# EAGLE design main (EAGLE 7.7.0)
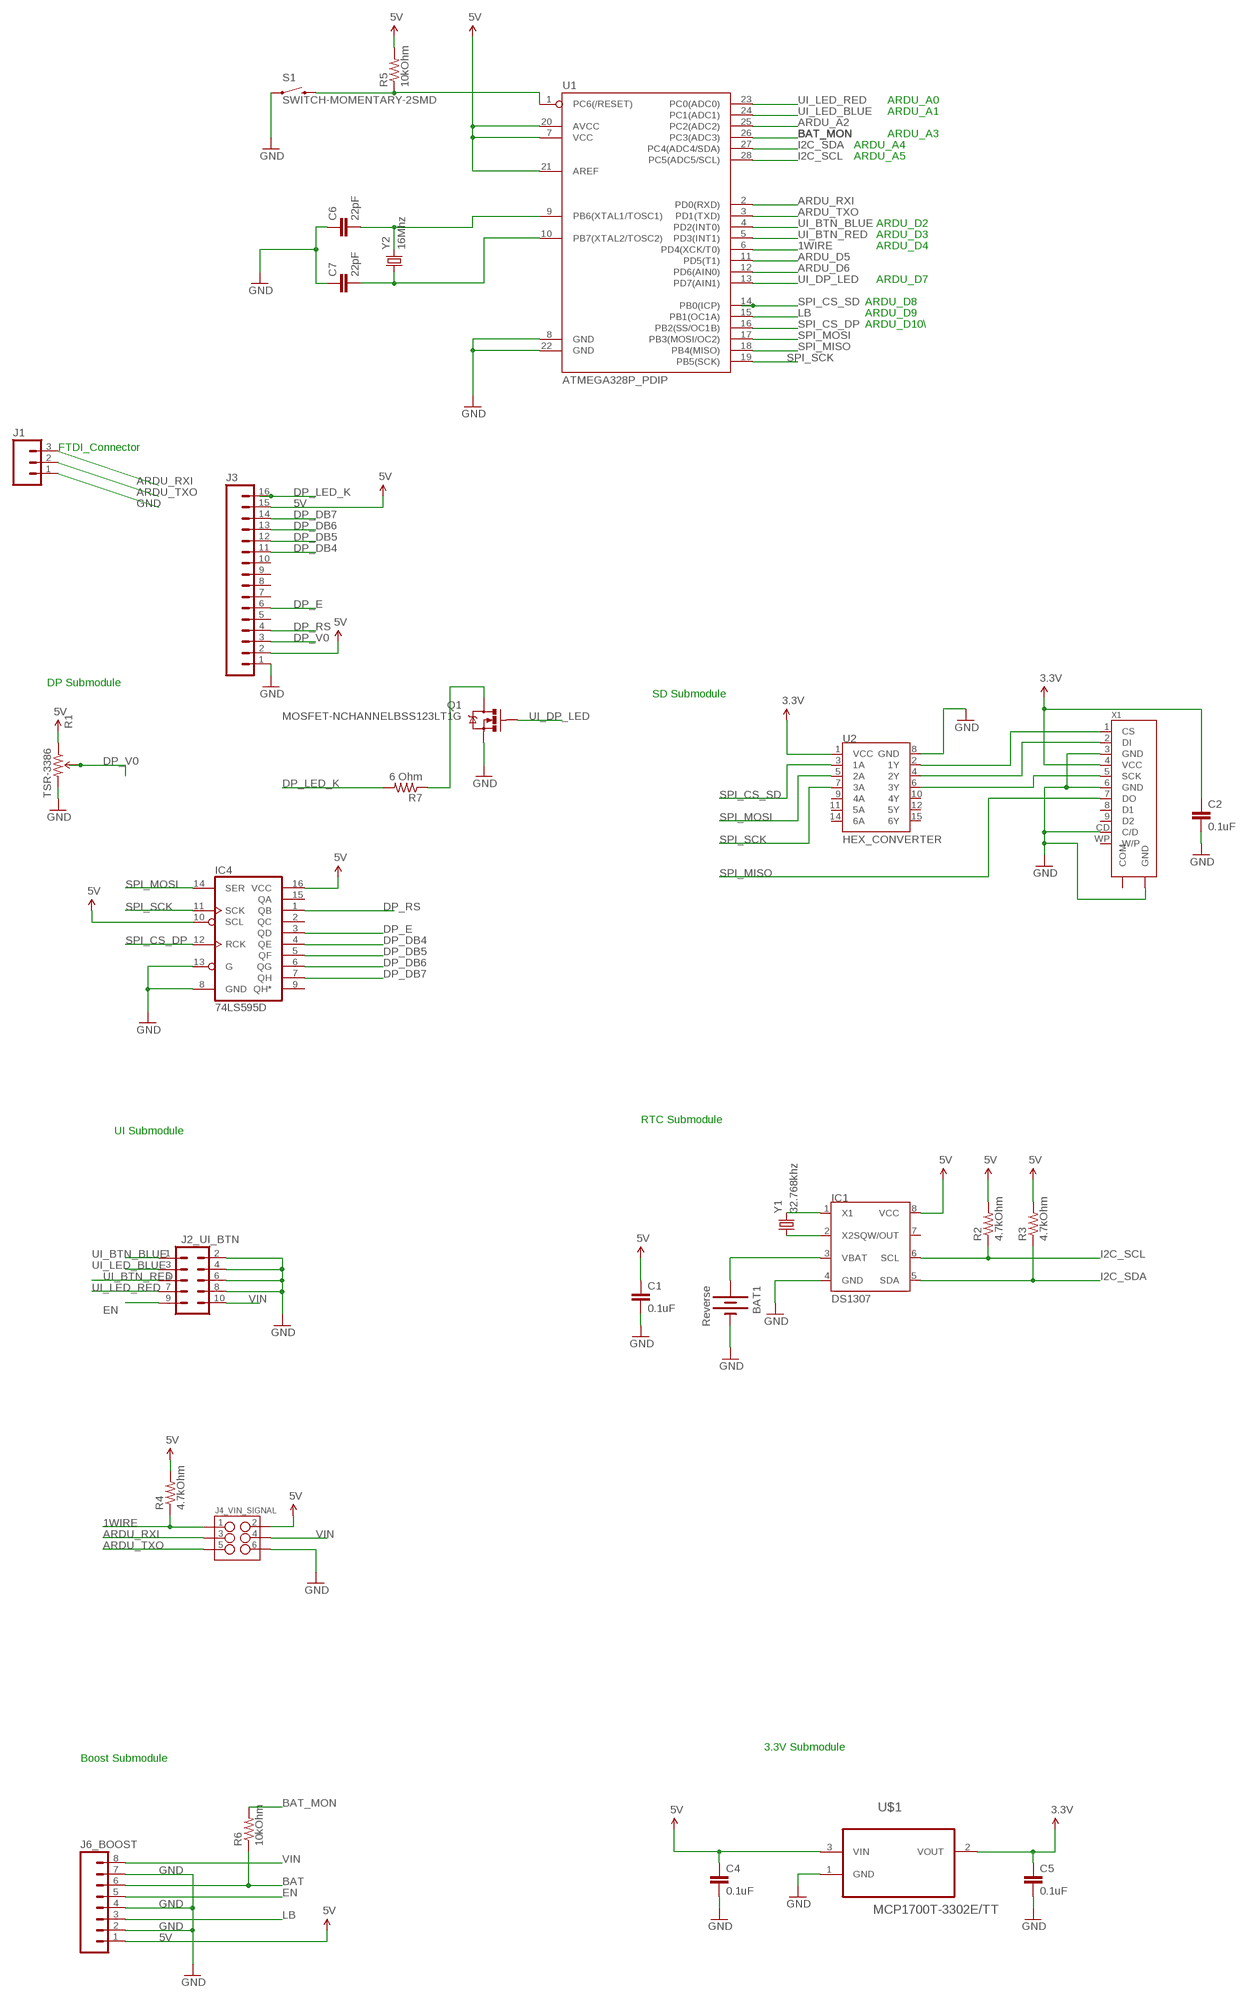
[diagram p0: schematic, sheet 1]

## Parts
BAT1  Reverse  BATTERY20PTH  [BATTCOM_20MM_PTH]
C1  0.1uF  CAP1206  [1206]
C2  0.1uF  CAP1206  [1206]
C4  0.1uF  CAP1206  [1206]
C5  0.1uF  CAP1206  [1206]
C6  22pF  CAP1206  [1206]
C7  22pF  CAP1206  [1206]
IC1  DS1307  [SOIC-8]
IC4  74LS595D  [SO16]
J1  M03LOCK  [1X03_LOCK]
J2_UI_BTN  M05X2SHD  [2X5-SHROUDED]
J3  M16PTH  [1X16]
J4_VIN_SIGNAL  M03X2SHROUD  [2X3-SHROUDED]
J6_BOOST  M08  [1X08_ROUND]
Q1  MOSFET-NCHANNELBSS123LT1G  [SOT23-3]
R1  TSR-3386  TRIMPOT-PTH-KNOB  [3386U]
R2  4.7kOhm  RESISTOR1206  [1206]
R3  4.7kOhm  RESISTOR1206  [1206]
R4  4.7kOhm  RESISTOR1206  [1206]
R5  10kOhm  RESISTOR1206  [1206]
R6  10kOhm  RESISTOR1206  [1206]
R7  6 Ohm  RESISTOR1206  [1206]
S1  SWITCH-MOMENTARY-2SMD  [TACTILE-SWITCH-SMD]
U1  ATMEGA328P_PDIP  [DIL28-3]
U2  HEX_CONVERTER  [SO016]
U$1  MCP1700T-3302E/TT  [SOT95P237X112-3N]
X1  SD-SOCKET-AVX  [SD-SOCKET-AVX]
Y1  32.768khz  CRYSTAL32-SMD-MELF  [CRYSTAL-32KHZ-SMD-MELF]
Y2  16Mhz  CRYSTALHC49US  [HC49US]

## Nets
1WIRE: J4_VIN_SIGNAL.1 R4.1 U1.6(PD4(XCK/T0))
3.3V [PWR]: C2.1 C5.1 U2.1(VCC) U$1.2(VOUT) X1.4(VCC)
5V [PWR]: C1.1 C4.1 IC1.8(VCC) IC4.10(SCL) IC4.16(VCC) J3.2 J3.15 J4_VIN_SIGNAL.2 J6_BOOST.1 R1.1(CCW) R2.2 R3.2 R4.2 R5.2 U1.7(VCC) U1.20(AVCC) U1.21(AREF) U$1.3(VIN)
ARDU_A2: U1.25(PC2(ADC2))
ARDU_D5: U1.11(PD5(T1))
ARDU_D6: U1.12(PD6(AIN0))
ARDU_RXI: J1.3 J4_VIN_SIGNAL.3 U1.2(PD0(RXD))
ARDU_TXO: J1.2 J4_VIN_SIGNAL.5 U1.3(PD1(TXD))
BAT: J6_BOOST.6 R6.1
BAT_MON: R6.2 U1.26(PC3(ADC3))
DP_DB4: IC4.4(QE) J3.11
DP_DB5: IC4.5(QF) J3.12
DP_DB6: IC4.6(QG) J3.13
DP_DB7: IC4.7(QH) J3.14
DP_E: IC4.3(QD) J3.6
DP_LED_K [PWR]: J3.16 R7.2
DP_RS: IC4.1(QB) J3.4
DP_V0: J3.3 R1.2(WIPER)
EN: J2_UI_BTN.9 J6_BOOST.5
GND [PWR]: BAT1.2(-) C1.2 C2.2 C4.2 C5.2 C6.1 C7.1 IC1.4(GND) IC4.8(GND) IC4.13(G) J1.1 J2_UI_BTN.2 J2_UI_BTN.4 J2_UI_BTN.6 J2_UI_BTN.8 J3.1 J4_VIN_SIGNAL.6 J6_BOOST.2 J6_BOOST.4 J6_BOOST.7 Q1.2(S) R1.3(CW) S1.1 U1.8(GND) U1.22(GND) U2.8(GND) U$1.1(GND) X1.3(GND) X1.6(GND) X1.CD(C/D) X1.GND@2(GND)
I2C_SCL: IC1.6(SCL) R2.1 U1.28(PC5(ADC5/SCL))
I2C_SDA: IC1.5(SDA) R3.1 U1.27(PC4(ADC4/SDA))
LB: J6_BOOST.3 U1.15(PB1(OC1A))
N$1: BAT1.1(+) IC1.3(VBAT)
N$2: IC1.2(X2) Y1.X1
N$3: IC1.1(X1) Y1.X2
N$4: U2.2(1Y) X1.1(CS)
N$5: U2.4(2Y) X1.2(DI)
N$6: U2.6(3Y) X1.5(SCK)
N$7: R5.1 S1.3 U1.1(PC6(/RESET))
N$8 [PWR]: Q1.3(D) R7.1
N$10: C6.2 U1.9(PB6(XTAL1/TOSC1)) Y2.2
N$11: C7.2 U1.10(PB7(XTAL2/TOSC2)) Y2.1
SPI_CS_DP: IC4.12(RCK) U1.16(PB2(SS/OC1B))
SPI_CS_SD: U1.14(PB0(ICP)) U2.3(1A)
SPI_MISO: U1.18(PB4(MISO)) X1.7(DO)
SPI_MOSI: IC4.14(SER) U1.17(PB3(MOSI/OC2)) U2.5(2A)
SPI_SCK: IC4.11(SCK) U1.19(PB5(SCK)) U2.7(3A)
UI_BTN_BLUE: J2_UI_BTN.1 U1.4(PD2(INT0))
UI_BTN_RED: J2_UI_BTN.5 U1.5(PD3(INT1))
UI_DP_LED: Q1.1(G) U1.13(PD7(AIN1))
UI_LED_BLUE: J2_UI_BTN.3 U1.24(PC1(ADC1))
UI_LED_RED: J2_UI_BTN.7 U1.23(PC0(ADC0))
VIN: J2_UI_BTN.10 J4_VIN_SIGNAL.4 J6_BOOST.8
Unconnected: IC1.7(SQW/OUT) IC4.2(QC) IC4.9(QH*) IC4.15(QA) J3.5 J3.7 J3.8 J3.9 J3.10 U2.9(4A) U2.10(4Y) U2.11(5A) U2.12(5Y) U2.14(6A) U2.15(6Y) X1.8(D1) X1.9(D2) X1.COM X1.WP(W/P)

## Notes on the sheet
- ARDU_A0
- ARDU_A1
- ARDU_A3
- ARDU_A4
- ARDU_A5
- ARDU_D2
- ARDU_D3
- ARDU_D4
- ARDU_D7
- ARDU_D8
- ARDU_D9
- ARDU_D10\
- FTDI_Connector
- DP Submodule
- SD Submodule
- RTC Submodule
- UI Submodule
- 3.3V Submodule
- Boost Submodule

## Library data of the parts
BAT1 = SparkFun-Electromechanical:BATTERY: Battery Holders Various common sizes : AA, AAA, 18650 (PRT-12895), 20mm coin cell and 12mm coin cell. 20MM_4LEGS, BATT-10373
C1 C2 C4-C7 = SparkFun-Passives:CAP: Capacitor Standard 0603 ceramic capacitor, and 0.1" leaded capacitor.
IC1 = dallas-1:DS1307: I2C Serial RTC w/56 bytes battery backed RAM
IC4 = SparkFun-DigitalIC:74*595: 8-bit SHIFT REGISTER, output latch; PROD_ID: IC-07875
J1 = SparkFun-Connectors:M03: Header 3 Standard 3-pin 0.1" header. Use with straight break away headers (SKU : PRT-00116), right angle break away headers (PRT-00553), swiss pins (PRT-00743), machine pins (PRT-00117), and female headers (PRT-00115). Molex polarized connector foot print use with SKU : PRT-08232 with associated crimp pins and housings.
J2_UI_BTN = SparkFun-Connectors:M05X2: Header 5x2 Standard 10-pin dual row 0.1" header. Commonly used with AVR-ISP. Use with Spark Fun Electronics SKU: PRT-00778
J3 = SparkFun-Connectors:M16: 1x16 .1" header
J4_VIN_SIGNAL = SparkFun-Connectors:M03X2: 2x3 .1" header. Shrouded, with keying- CONN-10681 SMT- CONN-11415 Pogo pins- HW-11044; PROD_ID: CONN-10681
J6_BOOST = SparkFun-Connectors:M08: Header 8 Standard 8-pin 0.1" header. Use with straight break away headers (SKU : PRT-00116), right angle break away headers (PRT-00553), swiss pins (PRT-00743), machine pins (PRT-00117), and female headers (PRT-00115).; PROD_ID: CONN-08437
Q1 = SparkFun-DiscreteSemi:MOSFET-NCHANNEL: Common NMOSFET Parts MFG P/N Store ID Prod ID FDD8780 TRANS-09984 SI7820DN TRANS-11055 FDS6630A IC-08089 2N7002PW TRANS-11151 FQP30N06L COM-10213 TRANS-10060 BSS123LT1G TRANS-08345 BSS138 TRANS-00830 BS170 2N7000; PROD_ID: TRANS-08345
R1 = SparkFun-Electromechanical:TRIMPOT: Various small potentiometers for "set-and-forget" applications; PROD_ID: RES-09730
R2-R7 = SparkFun-Resistors:RESISTOR: Resistor Basic schematic elements and footprints for 0603, 1206, and PTH resistors.
S1 = SparkFun-Electromechanical:SWITCH-MOMENTARY-2: Various NO switches- pushbuttons, reed, etc; PROD_ID: SWCH-08247
U1 = SparkFun-DigitalIC:ATMEGA328P_PDIP: uC used in the Arduino 32kb flash, 1k EEPROM, 2k SRAM This is the through-hole version of this chip.
U2 = SparkFun-DigitalIC:HEX_CONVERTER: 74HC4050 Hex Buffer Level Shifter SMD SO016; PROD_ID: IC-09604
U$1 = Microchip_By_element14_Batch_1:MCP1700T-3302E/TT: Low Quiescent Current LDO; MPN: MCP1700T-3302E/TT; OC_FARNELL: 1296592; OC_NEWARK: 88H9817; PACKAGE: SOT23-3; SUPPLIER: Microchip
X1 = Lumisense-SD-Socket:SD-SOCKET: SD-SOCKET; LPN: 181; NOTES: DIGIKEY 478-4061-1-ND
Y1 = SparkFun-FreqCtrl:CRYSTAL: Various standard crystals. Proven footprints.; PROD_ID: XTAL-07894
Y2 = SparkFun-FreqCtrl:CRYSTAL: Various standard crystals. Proven footprints.

## Net classes
1 PWR: width 0.254 mm, clearance 0.076 mm
2 3.3V: width 0.254 mm, clearance 0.127 mm

## Board
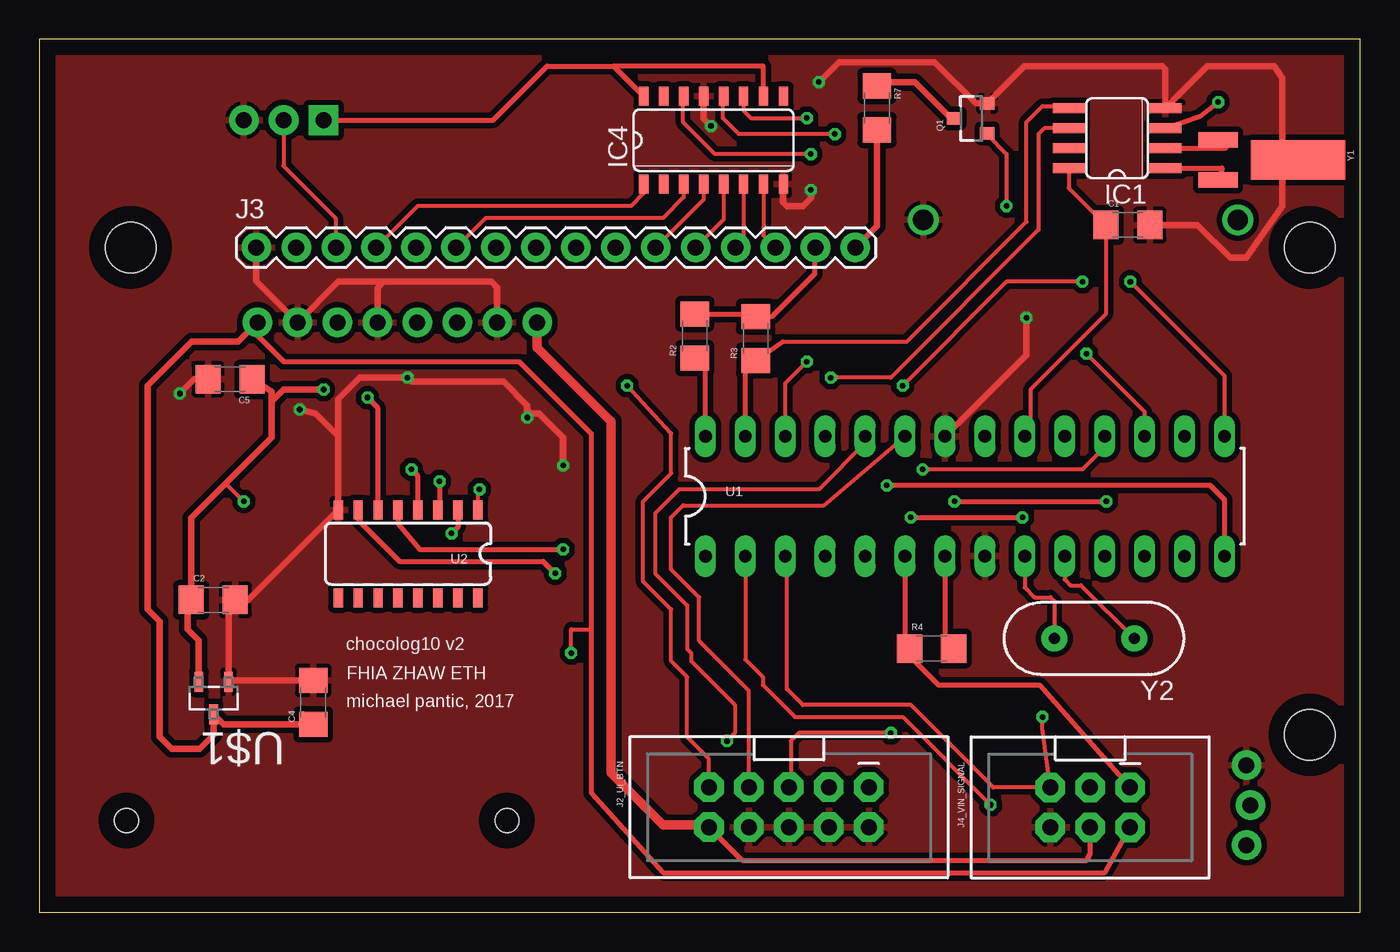
[diagram p1: board, top side]
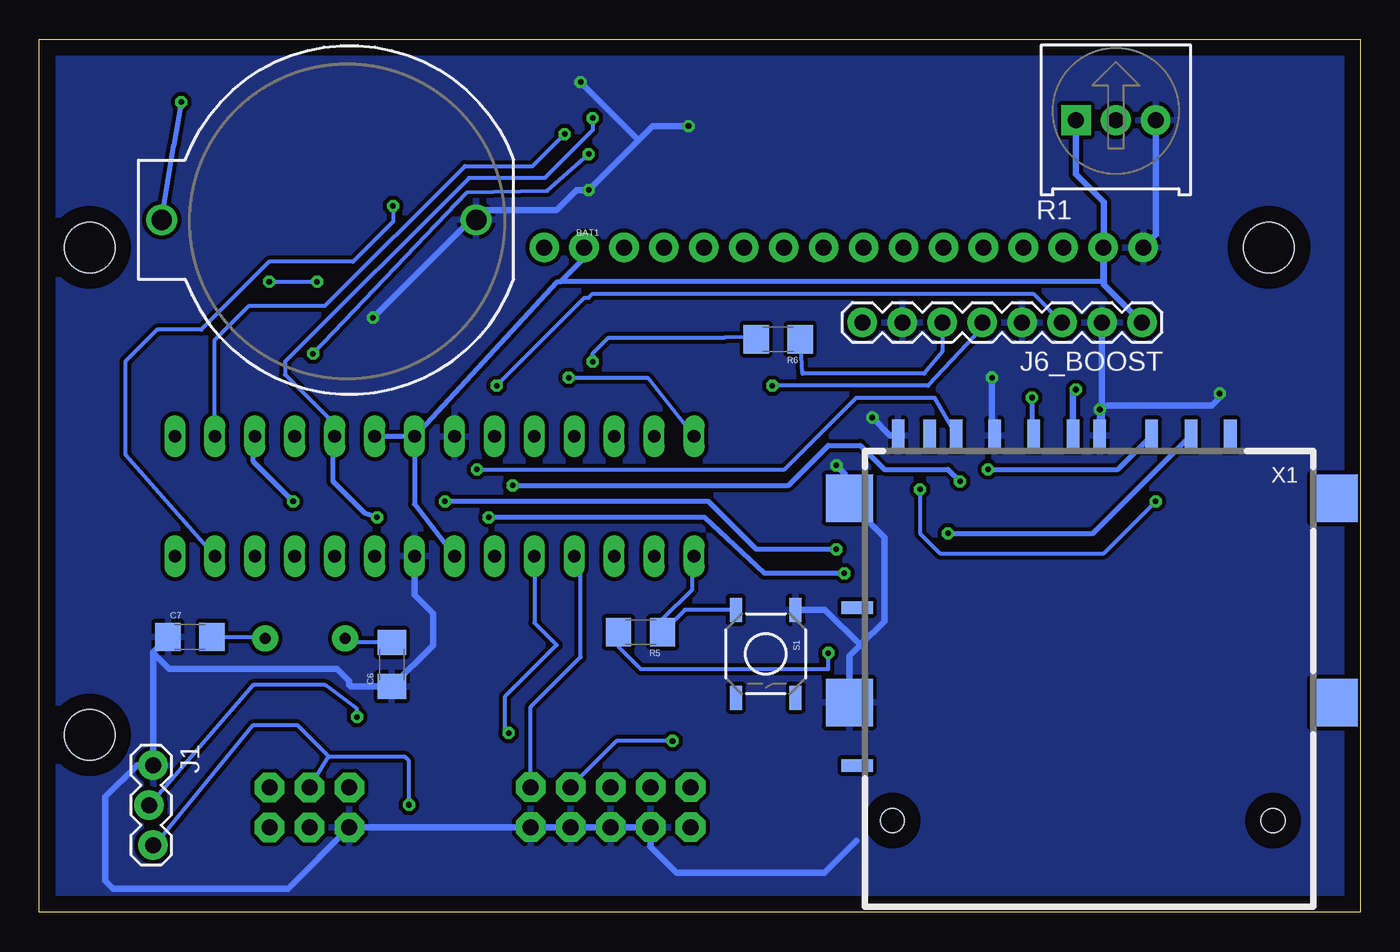
[diagram p2: board, bottom side, seen from below]

Size 84.01 x 55.53 mm. Coordinates in mm from the lower left corner, seen from the top.
Outline: 0,0 84.01,0 84.01,55.53 0,55.53 0,0
Copper layers (1*16): Top 0.035mm / dielectric 1.5mm / Bottom 0.035mm
Design rules "default *": minimum track width 9mil, minimum drill 0.3mm, track to track 10mil, track to pad 10mil, pad to pad 10mil, via to via 10mil, smd to smd 10mil, copper to edge 40mil, drill to drill 8mil, minimum pad ring 10mil, minimum via ring 8mil, stop-mask expansion 4mil, vias tented up to drill 0mil, thermal gap 10mil
Holes 3.2 mm at 5.8,42.29 80.8,42.29 80.8,11.29

### Footprints (pad centres in the part's own frame; a part is rotated, then mirrored left to right if it is on the bottom)
BATTCOM_20MM_PTH = drill 1.3: 1 11.85,0; 2 -8.15,0
1206 = smd 1.6 x 1.8: 1 -1.4,0; 2 1.4,0
SOIC-8 = smd 2.032 x 0.66: 1 -3.073,1.27; 2 -3.073,0; 3 -3.073,-1.27; 4 -3.073,-2.54; 5 3.073,-2.54; 6 3.073,-1.27; 7 3.073,0; 8 3.073,1.27
SO16 = smd 0.6 x 1.2: 1 -4.445,-2.8; 2 -3.175,-2.8; 3 -1.905,-2.8; 4 -0.635,-2.8; 5 0.635,-2.8; 6 1.905,-2.8; 7 3.175,-2.8; 8 4.445,-2.8; 9 4.445,2.8; 10 3.175,2.8; 11 1.905,2.8; 12 0.635,2.8; 13 -0.635,2.8; 14 -1.905,2.8; 15 -3.175,2.8; 16 -4.445,2.8
1X03_LOCK = drill 1.016 pad 1.88: 1 0,0.127; 2 2.54,-0.127; 3 5.08,0.127
2X5-SHROUDED = drill 1.016 pad 1.88 octagon: 1 -1.27,5.08; 2 1.27,5.08; 3 -1.27,2.54; 4 1.27,2.54; 5 -1.27,0; 6 1.27,0; 7 -1.27,-2.54; 8 1.27,-2.54; 9 -1.27,-5.08; 10 1.27,-5.08
1X16 = drill 1.016 pad 1.88: 1 0,0; 2 2.54,0; 3 5.08,0; 4 7.62,0; 5 10.16,0; 6 12.7,0; 7 15.24,0; 8 17.78,0; 9 20.32,0; 10 22.86,0; 11 25.4,0; 12 27.94,0; 13 30.48,0; 14 33.02,0; 15 35.56,0; 16 38.1,0
2X3-SHROUDED = drill 1.016 pad 1.88 octagon: 1 -1.27,2.54; 2 1.27,2.54; 3 -1.27,0; 4 1.27,0; 5 -1.27,-2.54; 6 1.27,-2.54
1X08_ROUND = drill 1.016 pad 1.88: 1 0,0; 2 2.54,0; 3 5.08,0; 4 7.62,0; 5 10.16,0; 6 12.7,0; 7 15.24,0; 8 17.78,0
SOT23-3 = smd 0.8 x 0.9: 1 -0.95,-1; 2 0.95,-1; 3 0,1.1
3386U = drill 1.016 pad 1.88 square: 1 -2.54,-0.015 | drill 1.016 pad 1.88: 2 0,-0.015; 3 2.54,-0.015
TACTILE-SWITCH-SMD = smd 1.524 x 0.762: 1 -2.794,1.905; 2 2.794,1.905; 3 -2.794,-1.905; 4 2.794,-1.905
DIL28-3 = drill 0.813 long: 1 -16.51,-3.81; 2 -13.97,-3.81; 3 -11.43,-3.81; 4 -8.89,-3.81; 5 -6.35,-3.81; 6 -3.81,-3.81; 7 -1.27,-3.81; 8 1.27,-3.81; 9 3.81,-3.81; 10 6.35,-3.81; 11 8.89,-3.81; 12 11.43,-3.81; 13 13.97,-3.81; 14 16.51,-3.81; 15 16.51,3.81; 16 13.97,3.81; 17 11.43,3.81; 18 8.89,3.81; 19 6.35,3.81; 20 3.81,3.81; 21 1.27,3.81; 22 -1.27,3.81; 23 -3.81,3.81; 24 -6.35,3.81; 25 -8.89,3.81; 26 -11.43,3.81; 27 -13.97,3.81; 28 -16.51,3.81
SO016 = smd 0.6 x 1.2: 1 -4.445,-2.8; 2 -3.175,-2.8; 3 -1.905,-2.8; 4 -0.635,-2.8; 5 0.635,-2.8; 6 1.905,-2.8; 7 3.175,-2.8; 8 4.445,-2.8; 9 4.445,2.8; 10 3.175,2.8; 11 1.905,2.8; 12 0.635,2.8; 13 -0.635,2.8; 14 -1.905,2.8; 15 -3.175,2.8; 16 -4.445,2.8
SOT95P237X112-3N = smd 0.559 x 1.27: 1 -0.94,-1.041; 2 0.94,-1.041; 3 0,1.041
SD-SOCKET-AVX = smd 0.8 x 2: 1 -6.88,-1; 2 -4.38,-1; 3 -1.08,-1; 4 0.62,-1; 5 3.12,-1; 6 5.62,-1; 7 8.05,-1; 8 9.75,-1; 9 -9.38,-1; CD 11.75,-1 | smd 2 x 0.8: COM 14.35,9.95; WP 14.35,20 | smd 3 x 3: GND@1 -16,3; GND@2 14.85,16; GND@3 -16,16; GND@4 14.85,3 | hole 1.5: 12.1,23.5; -12.1,23.5
CRYSTAL-32KHZ-SMD-MELF = smd 2.5 x 6: SHEILD 0,5.08 | smd 1 x 2.5: X1 -1.27,0; X2 1.27,0
HC49US = drill 0.7 pad 1.651: 1 -2.54,0; 2 2.54,0

### Placement (x,y rotation side)
BAT1  64.38,44.05 180 bottom
C1  69.23,43.72 0 top
C2  11.06,19.88 0 top
C4  17.42,13.36 90 top
C5  12.13,33.91 180 top
C6  61.59,15.76 90 bottom
C7  74.43,17.52 0 bottom
IC1  68.54,48.61 180 top
IC4  42.88,49.11 0 top
J1  76.9,9.35 270 bottom
J2_UI_BTN  47.67,6.69 270 top
J3  13.8,42.29 0 top
J4_VIN_SIGNAL  66.83,6.67 270 top
J6_BOOST  13.88,37.52 180 bottom
Q1  59.29,50.5 90 top
R1  15.54,50.4 0 bottom
R2  41.68,36.66 90 top
R3  45.56,36.5 90 top
R4  56.75,16.78 0 top
R5  45.77,17.82 180 bottom
R6  37.01,36.45 180 bottom
R7  53.27,51.17 270 top
S1  37.81,16.44 270 bottom
U1  58.87,26.47 0 top
U2  23.45,22.8 180 top
U$1  11.09,13.63 180 top
X1  17.64,29.34 180 bottom
Y1  74.97,47.86 270 top
Y2  67.09,17.42 180 top

### Tracks (layer width: path | path; a pad name or v marks a point on that pad's centre or on a via)
1WIRE
  Top 0.305: U1.6 55.06,17.07 R4.1 55.35,16.3 57.2,14.45 63.62,14.45 J4_VIN_SIGNAL.1
3.3V  (via drill 0.36)
  Top 0.254: U2.1 27.9,26.81 v27.99,26.9 | v13,26.14 11.86,27.28
  Top 0.406: C2.1 9.66,19.82 9.7,19.79 | U$1.2 10.15,17.31 9.45,18.01 9.45,19.66 C2.1 | C2.1 9.66,25.09 11.86,27.28 14.78,30.2 14.78,32.49 | 14.78,32.49 14.78,33.13 C5.1 | v18.08,33.25 15.54,33.25 14.78,32.49
  Bottom 0.254: v27.99,26.9 27.99,24.11 26.72,22.84 16.3,22.84 v13,26.14
  Bottom 0.406: X1.4 18.26,33.07 v18.08,33.25
5V  (via drill 0.36)
  Top 0.254: IC1.8 65.47,46.08 C1.1 67.83,38.04 63.04,33.25 63.04,31.4 U1.20 | v33.83,16.49 33.83,18.01 35.1,18.01
  Top 0.305: U1.7 57.6,17.33 R4.2 | R2.2 45.4,38.06 R3.2 46.61,37.9 49.32,40.62 49.32,42.25 J3.15 | R1.1 28.87,50.39 32.31,53.82 36.52,53.82 | 36.52,53.82 IC4.16 | IC4.10 46.06,53.79 46.02,53.82 36.52,53.82 | J6_BOOST.1 13.88,36.69 15.54,35.03 30.53,35.03 35.1,30.46 35.1,18.01 35.1,7.6 39.67,2.52 67.76,2.52 J4_VIN_SIGNAL.2
  Top 0.406: 16.79,12.59 C4.1 11.72,11.96 U$1.3 11.09,11.27 10.21,10.39 8.43,10.39 7.67,11.15 7.67,18.52 6.91,19.28 6.91,33.5 9.7,36.3 12.66,36.3 J6_BOOST.1
  Bottom 0.254: R5.2 47.17,16.87 45.77,15.47 33.83,15.47 v33.83,16.49
  Bottom 0.305: 16.3,40.11 50.85,40.11 | U1.21 51.07,40.11 50.85,40.11 | U1.21 U1.20 | U1.21 60.14,25.96 U1.7 | 50.85,40.11 49.32,41.63 49.32,42.25 J3.15 49.36,42.61 49.32,42.65
  Bottom 0.406: R1.1 18.08,46.96 16.3,45.19 16.3,40.31 | 16.3,40.31 16.3,40.11 16.3,39.94 J6_BOOST.1 | J3.2 16.34,40.35 16.3,40.31
ARDU_RXI  (via drill 0.36)
  Top 0.254: U1.2 44.9,16.08 46.02,14.96 46.02,14.45 48.05,12.42 54.91,12.42 v60.5,6.83
  Bottom 0.254: v60.5,6.83 60.5,9.63 60.75,9.88 65.58,9.88 | 65.58,9.88 65.65,9.88 J4_VIN_SIGNAL.3 | J1.3 76.27,4.78 70.41,11.91 67.61,11.91 65.58,9.88
ARDU_TXO  (via drill 0.36)
  Top 0.254: U1.3 47.55,22.55 47.55,14.2 48.56,13.18 55.42,13.18 60.66,7.94 J4_VIN_SIGNAL.5 63.78,11.68 v63.8,12.42
  Bottom 0.254: v63.8,12.42 63.8,12.93 65.83,14.45 70.4,14.45 J1.2
BAT
  Bottom 0.254: J6_BOOST.6 26.58,35.67 27.73,34.27 35.46,34.27 R6.1
BAT_MON  (via drill 0.36)
  Top 0.254: U1.26 47.44,33.65 v48.82,35.03
  Bottom 0.254: R6.2 38.94,36.58 40.43,36.55 47.8,36.55 48.82,35.54 v48.82,35.03
DP_DB4
  Top 0.254: IC4.4 42.25,45.34 J3.11
DP_DB5
  Top 0.254: IC4.5 43.52,44.06 J3.12
DP_DB6
  Top 0.254: IC4.6 44.79,42.79 J3.13
DP_DB7
  Top 0.254: IC4.7 46.06,43.05 J3.14
DP_E
  Top 0.254: IC4.3 40.98,45.48 39.67,44.17 28.38,44.17 J3.6
DP_LED_K
  Top 0.406: R7.2 53.27,43.66 J3.16
DP_RS
  Top 0.254: IC4.1 38.44,45.73 37.64,44.93 24.07,44.93 J3.4
DP_V0
  Top 0.254: R1.2 15.54,47.48 18.84,44.17 18.84,42.11 18.84,41.89 19.1,41.63
  Top 0.406: J3.3 18.88,42.15 18.84,42.11
EN  (via drill 0.36)
  Top 0.254: J2_UI_BTN.9 42.59,9.76 41.2,11.15 41.2,14.96 40.18,15.98 40.18,19.28 38.4,21.06 38.4,26.14 40.18,27.92 40.18,30.46 v37.39,33.5
  Bottom 0.254: J6_BOOST.5 24.04,37.2 27.48,33.5 v37.39,33.5
GND  (via drill 0.36)
  Top 0.406: J3.1 13.8,40.14 J6_BOOST.2 19.01,40.11 21.89,40.11 | J6_BOOST.7 29.12,39.74 28.75,40.11 21.89,40.11 | J6_BOOST.4 21.5,39.72 21.89,40.11 | IC4.13 42.25,50.49 v42.72,50.01 | v49.07,45.95 49.07,45.44 48.56,44.93 47.55,44.93 47.29,45.19 47.29,46.27 IC4.8 | C1.2 73.65,43.72 75.74,41.63 76.76,41.63 79.04,44.93 79.04,53.06 78.53,53.82 74.29,53.82 IC1.4 71.62,53.63 71.42,53.82 62.66,53.82 Q1.2 59.57,51.45 56.94,54.08 50.85,54.08 v49.58,52.81 | C4.2 12.12,14.76 U$1.1 12.03,19.44 C2.2 13.29,19.88 U2.8 19.01,30.29 | 19.01,30.29 17.57,31.73 v16.56,31.98 | C5.2 9.85,33.91 v8.94,33 | 19.01,30.29 19.01,32.65 20.37,34.01 v23.42,34.01 23.67,33.76 29.51,33.76 31.04,32.23 31.04,31.98 | v31.04,31.47 31.04,31.98 | v33.32,28.42 33.32,30.2 31.8,31.73 31.29,31.73 31.04,31.98 | v62.79,37.82 62.79,35.46 U1.22
  Bottom 0.406: R1.3 13,43.09 J3.1 | v42.72,50.01 45.01,50.01 45.9,49.12 | 45.9,49.12 v49.07,45.95 49.83,45.95 51.1,44.68 55.59,44.68 BAT1.2 56.56,44.05 v62.79,37.82 | v49.58,52.81 45.9,49.12 | 76.78,16.49 J1.1 77.8,9.35 79.8,7.34 79.8,2.01 79.3,1.5 68.19,1.5 J4_VIN_SIGNAL.6 52.77,5.4 J2_UI_BTN.2 J2_UI_BTN.4 J2_UI_BTN.6 J2_UI_BTN.8 45.13,4.17 43.48,2.52 34.08,2.52 32.05,4.55 | 76.78,16.49 76.78,16.57 C7.1 | 32.05,12.9 X1.GND@2 32.49,16.3 31.8,16.99 | 31.8,16.99 30.27,18.52 30.27,23.85 32.81,26.39 32.81,27.92 v33.32,28.42 | S1.1 34.04,19.24 31.8,16.99 | J6_BOOST.2 16.42,30.48 X1.3 v16.56,31.98 16.05,32.23 9.45,32.23 8.94,32.74 v8.94,33 | v23.42,34.01 23.42,30.49 X1.6 | X1.CD 29.9,30.34 v31.04,31.47 | U1.8 60.14,20.19 58.98,19.03 58.98,16.97 C6.1 64.22,14.36 64.31,14.45 64.31,14.71 65.07,15.47 75.76,15.47 76.78,16.49
  pour Bottom (isolate 0.254): 0.56,54.84 0.56,0.23 82.85,0.23 83.11,54.84
  pour Top (isolate 0.356): 0.3,54.84 82.85,54.84 82.85,0.23 0.3,0.23
I2C_SCL  (via drill 0.36)
  Top 0.254: IC1.6 63.92,49.88 63.55,49.51 63.55,43.41 54.15,34.01 v50.34,34.01
  Top 0.305: U1.28 42.36,34.58 R2.1
  Bottom 0.254: v50.34,34.01 45.33,34.01 U1.28
I2C_SDA
  Top 0.254: 47.29,36.3 55.17,36.3 62.79,43.92 62.79,50.27 63.8,51.28 65.73,51.28 66.09,51.28 66.34,51.03
  Top 0.305: U1.27 44.9,34.44 R3.1 45.58,35.1 47.29,36.3
  Top 0.406: IC1.5 65.6,51.15 65.73,51.28
LB  (via drill 0.36)
  Top 0.254: U1.15 75.38,34.12 v69.39,40.11 | v66.34,40.11 61.52,40.11 v54.91,33.5
  Bottom 0.254: v69.39,40.11 v66.34,40.11 | v54.91,33.5 49.32,39.09 49.07,39.09 48.82,39.35 20.79,39.35 J6_BOOST.3
N$1  (via drill 0.36)
  Top 0.305: IC1.3 73.83,50.64 v74.98,51.54
  Bottom 0.305: BAT1.1 75.46,48.77 v74.98,51.54
N$2
  Top 0.305: IC1.2 75.47,48.61 Y1.X1
N$3
  Top 0.305: IC1.1 75.23,47.34 Y1.X2
N$4  (via drill 0.36)
  Top 0.305: U2.2 26.63,24.52 v26.21,24.11
  Bottom 0.305: v26.21,24.11 16.99,24.11 X1.1
N$5  (via drill 0.36)
  Top 0.305: U2.4 24.09,27.75 v23.67,28.17
  Bottom 0.305: v23.67,28.17 15.43,28.17 X1.2
N$6  (via drill 0.36)
  Top 0.305: U2.6 21.55,32.07 v20.88,32.74
  Bottom 0.305: v20.88,32.74 20.88,30.45 X1.5
N$7
  Bottom 0.254: S1.3 42.95,19.24 R5.1 44.37,18.65 42.47,20.55 42.47,22.55 U1.1
N$8
  Top 0.406: Q1.3 57.98,50.5 55.67,52.81 53.51,52.81 R7.1
N$10
  Top 0.254: U1.9 62.68,20.65 63.29,20.04 64.31,20.04 64.56,19.79 64.56,17.43 Y2.2
  Bottom 0.254: C6.2 64.29,17.16 Y2.2
N$11
  Top 0.254: U1.10 65.22,21.16 65.58,20.8 66.25,20.8 Y2.1
  Bottom 0.254: C7.2 69.73,17.52 Y2.1
SPI_CS_DP  (via drill 0.36)
  Top 0.254: v50.59,49.51 44.5,49.51 43.48,50.52 43.48,51.88 IC4.12
  Bottom 0.254: U1.16 72.84,36.4 70.66,38.58 65.83,38.58 56.94,47.47 52.63,47.47 v50.59,49.51
SPI_CS_SD  (via drill 0.36)
  Top 0.305: U1.14 75.38,26.24 74.47,27.15 v53.9,27.15 | v25.45,27.41 25.45,25.69 U2.3
  Bottom 0.305: v53.9,27.15 36.37,27.15 33.83,29.69 31.8,29.69 30.27,28.17 26.21,28.17 v25.45,27.41
SPI_MISO  (via drill 0.36)
  Top 0.254: U1.18 67.76,29.59 66.34,28.17 v56.18,28.17
  Bottom 0.254: v56.18,28.17 36.62,28.17 32.05,32.74 27.08,32.74 X1.7
SPI_MOSI  (via drill 0.36)
  Top 0.254: U1.17 70.3,31.83 v66.6,35.54 | v49.07,48.24 42.97,48.24 40.94,50.27 40.94,51.88 IC4.14
  Top 0.305: U2.5 22.82,24.71 24.18,23.09 v33.32,23.09 | v58.21,26.14 v67.87,26.14
  Bottom 0.254: v49.07,48.24 51.71,45.9 56.79,45.8 v66.6,35.54
  Bottom 0.305: v33.32,23.09 38.4,23.09 41.45,26.14 v58.21,26.14 | v67.87,26.14 70.41,28.68 70.41,30.94 U1.17
SPI_SCK  (via drill 0.36)
  Top 0.254: IC4.11 44.79,50.99 45.26,50.52 v48.82,50.52
  Top 0.305: U2.7 20.28,24.96 22.91,22.33 32.05,22.33 v32.81,21.57 | v55.42,25.12 v62.53,25.12
  Bottom 0.254: v48.82,50.52 48.82,49.76 51.86,46.71 56.69,46.71 68.37,35.03 68.37,34.19 65.62,31.43 U1.19
  Bottom 0.305: v32.81,21.57 37.89,21.57 41.7,25.12 v55.42,25.12 | v62.53,25.12 63.29,25.38 65.33,27.41 65.33,31.14 65.62,31.43
UI_BTN_BLUE
  Bottom 0.254: J2_UI_BTN.1 52.75,13.06 49.58,16.23 49.58,23.02 U1.4
UI_BTN_RED  (via drill 0.36)
  Top 0.254: v54.15,11.41 48.31,11.41 47.8,10.9 47.8,8.09 J2_UI_BTN.5
  Bottom 0.254: U1.5 52.52,18.41 51.1,16.99 54.4,13.69 54.4,11.66 v54.15,11.41
UI_DP_LED  (via drill 0.36)
  Top 0.254: Q1.1 60.29,49.47 61.52,48.24 v61.52,44.93
  Bottom 0.254: v61.52,44.93 61.52,43.92 64.06,41.38 69.39,41.38 73.71,37.06 76.5,37.06 78.53,35.03 78.53,29.11 U1.13
UI_LED_BLUE  (via drill 0.36)
  Top 0.254: U1.24 52.52,29.84 49.58,26.9 40.69,26.9 39.16,25.38 39.16,21.57 41.2,19.53 41.2,16.74 41.45,16.49 41.45,15.98 44.24,13.18 44.24,11.41 v43.74,10.9
  Bottom 0.254: v43.74,10.9 47.29,10.9 50.59,7.6 50.58,7.6 J2_UI_BTN.3
UI_LED_RED
  Top 0.254: J2_UI_BTN.7 45.13,14.07 41.96,17.25 41.96,20.04 40.18,21.82 40.18,25.12 40.94,25.88 49.91,25.88 U1.23
VIN
  Top 0.305: J4_VIN_SIGNAL.4 66.83,3.77 66.6,3.28 44.73,3.28 J2_UI_BTN.10
  Top 0.406: 43.23,5.56 42.59,5.56 J2_UI_BTN.10
  Top 0.61: J6_BOOST.8 31.66,35.93 36.37,31.22 36.37,8.87 39.67,5.56 43.23,5.56

### Text on the board
tPlace: chocolog10 v2 | chocolog10 v2 | FHIA ZHAW ETH | michael pantic, 2017